# Altium project Supply_unit-RM.PrjPcb
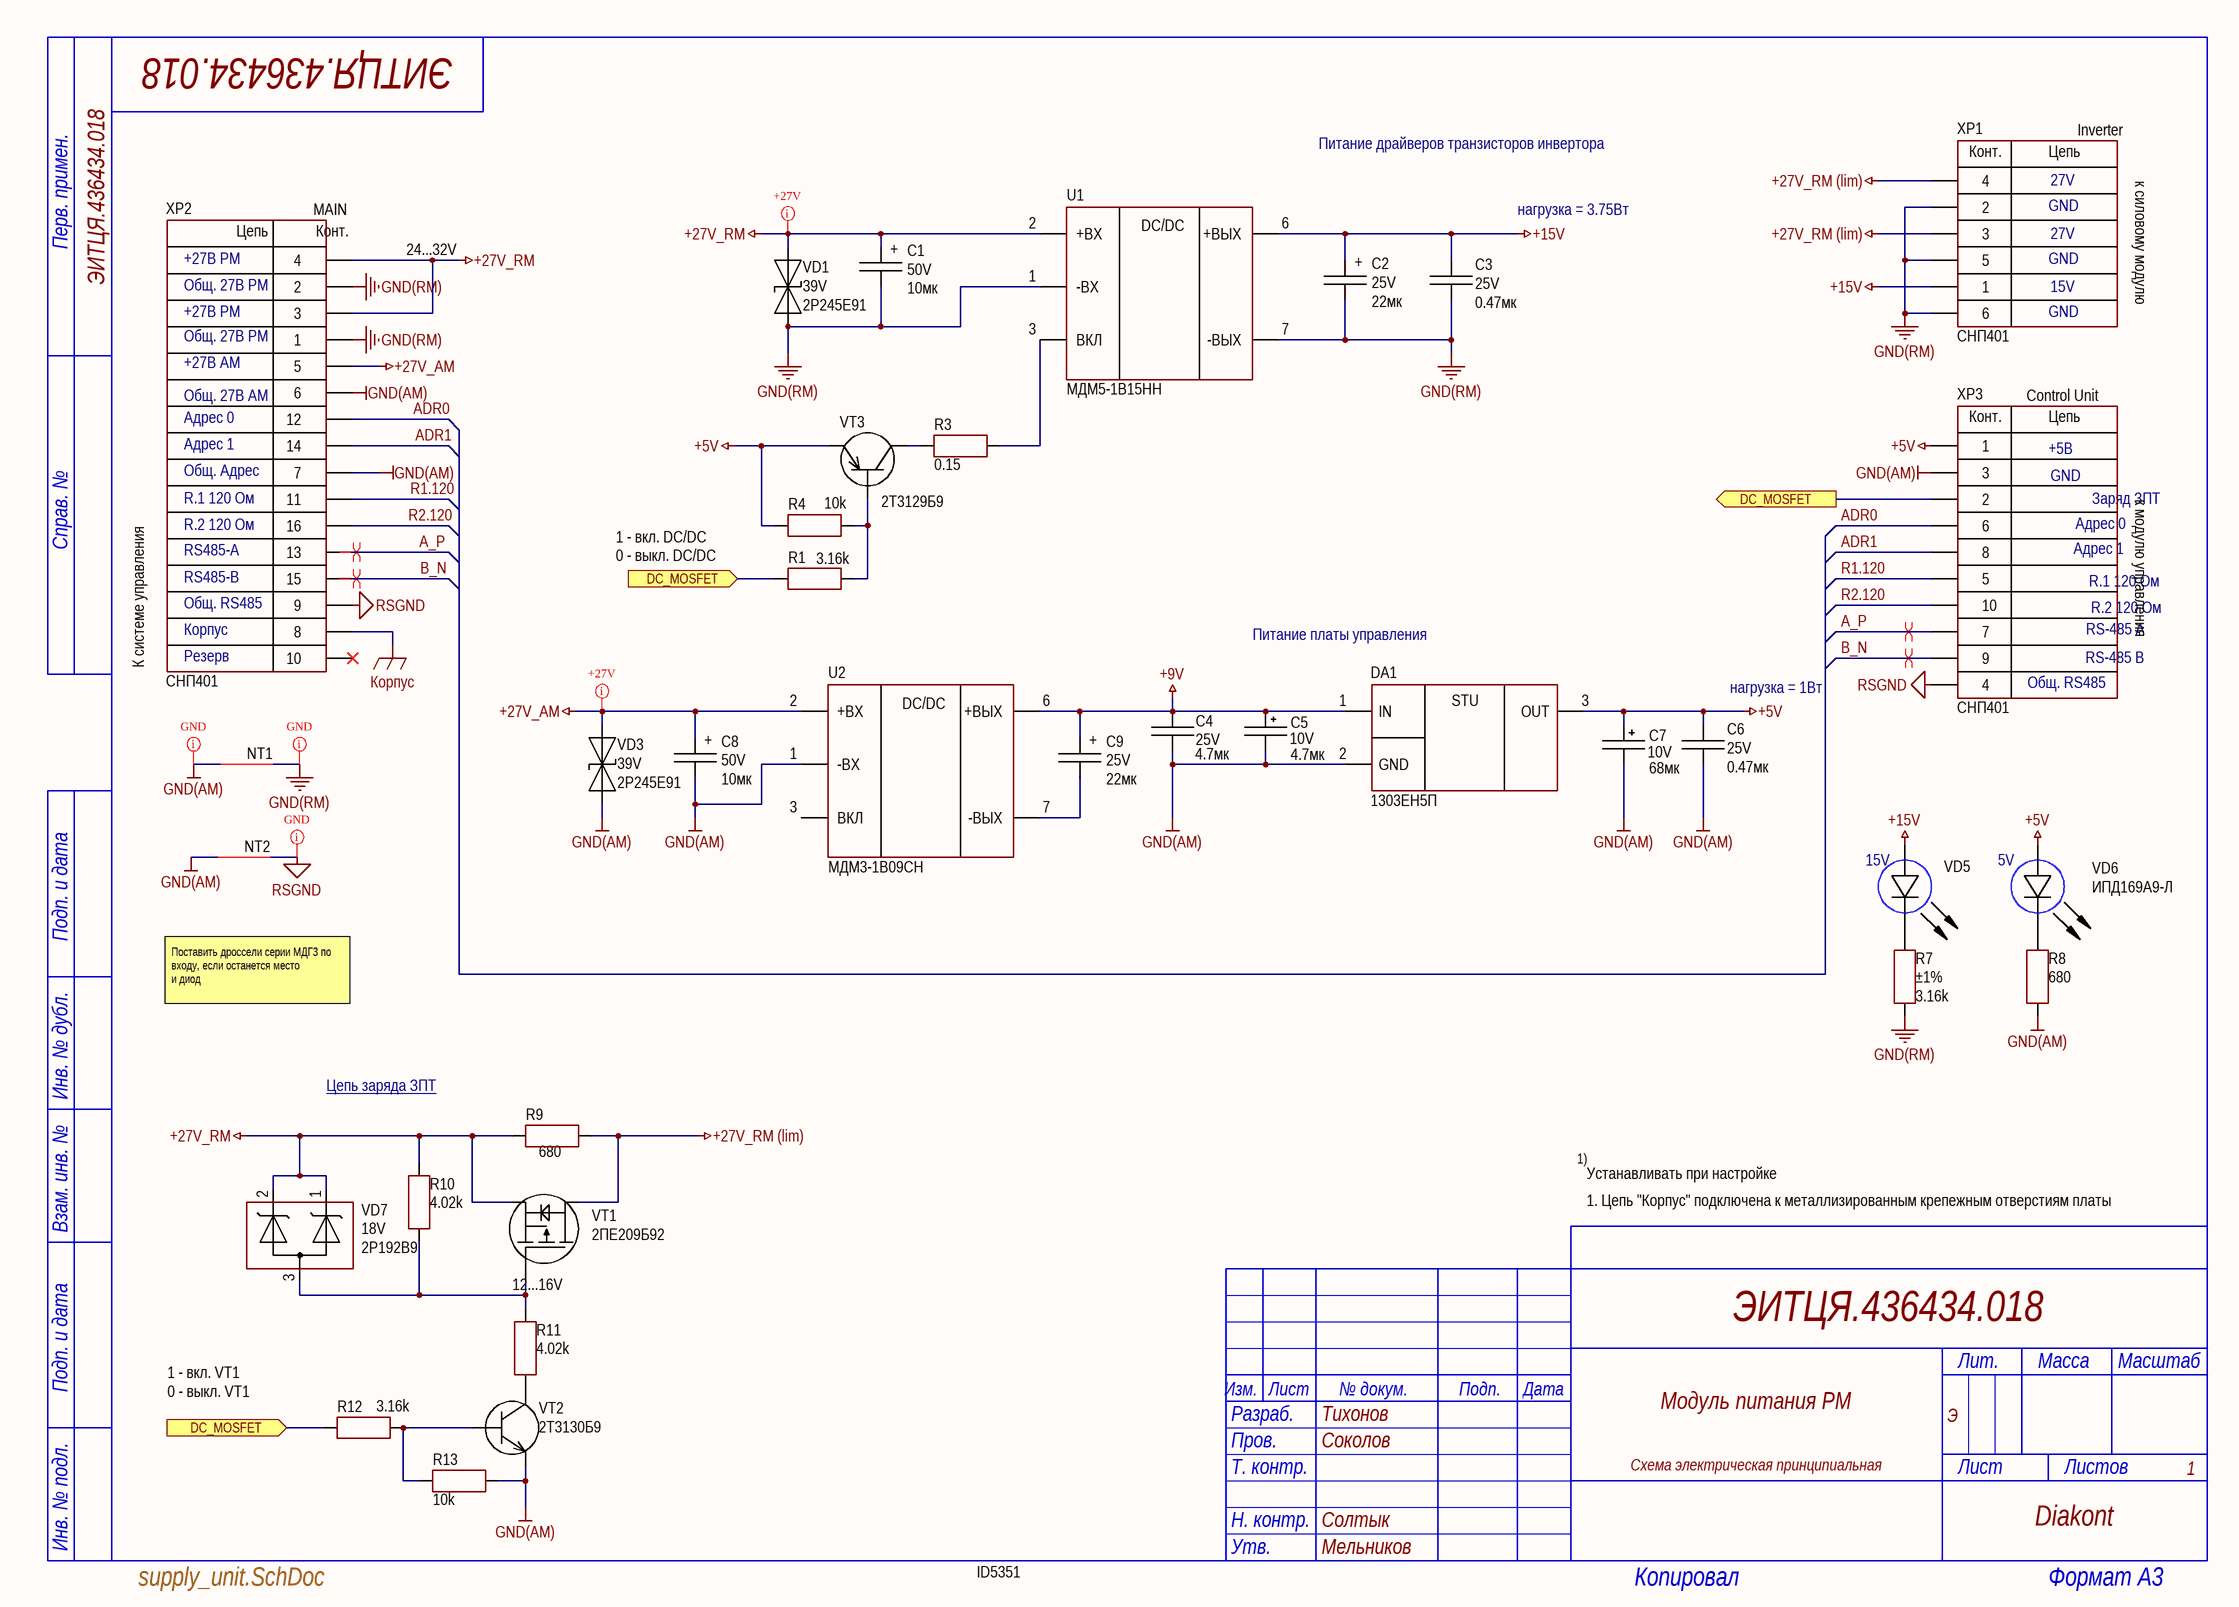
[diagram p0: supply_unit.SchDoc]
1 sheet, 35 parts. Net scope: flat (ports and power ports of the same name join across sheets).
Board file: PCB_supply unit.PcbDoc

## Sheet supply_unit.SchDoc: Модуль питания РМ
size 420 x 297 mm; Date: 2019-11-22; ApprovedBy: Мельников; CheckedBy: Соколов; CompanyName: Diakont; DrawnBy: Тихонов; DocumentNumber: ЭИТЦЯ.436434.018; Revision: A; SheetTotal: 1; DocumentType: Схема электрическая принципиальная; Liter: Э; NormControl: Солтык; PageSetup: Record=PageOptions|CenterHorizontal=True|CenterVertical=True|PrintScale=0.96|XCorrection=1.00|YCorrection=1.00|PrintKind=1|BorderSize=5000000|LeftOffset=0|BottomOffset=0|Orientation=2|PaperLength=1000|PaperWidth=1000|Scale=100|PaperSource=7|PrintQuality=-4|MediaType=1|DitherType=10|PaperKind=A3|PrintScaleMode=1; FirstApp: ЭИТЦЯ.436434.018; Language: en; ResponsibleDept: DED; DocumentStatus: Released; DecimalNumber: {DecimalNumber}

### Parts
C1  value 10мк  Polarity: +  Voltage: 50V  [CAP: TANTAL-E]
C2  value 22мк  Polarity: +  Voltage: 25V  [CAP: TANTAL-D]
C3  value 0.47мк  Voltage: 25V  [CAP: 1206]
C4  value 4.7мк  Voltage: 25V  [CAP: 1812]
C5  value 4.7мк  Voltage: 10V  [CAP: TANTAL-A]
C6  value 0.47мк  Voltage: 25V  [CAP: 1206]
C7  value 68мк  Voltage: 10V  [CAP: TANTAL-C]
C8  value 10мк  Polarity: +  Voltage: 50V  [CAP: TANTAL-E]
C9  value 22мк  Polarity: +  Voltage: 25V  [CAP: TANTAL-D]
DA1  (no value)  [TO220 (КТ-28А)]
NT1  (no value)  [NetTie_0603]  (net tie, no BOM)
NT2  (no value)  [NetTie_0603]  (net tie, no BOM)
R1  value 3.16k  [RES: 0603P]
R3  value 0.15  [RES: 0603P]
R4  value 10k  [RES: 0603P]
R7  value 3.16k  Tolerance: ±1%  [RES: 0603P]
R8  value 680  [RES: 0603P]
R9  value 680  [RES: 0805P]
R10  value 4.02k  [RES: 0805P]
R11  value 4.02k  [RES: 0805P]
R12  value 3.16k  [RES: 0603P]
R13  value 10k  [RES: 0603P]
U1  PartNumber: МДМ5-1В15НН  [SIP-8]
U2  (no value)  [SIP-8]
VD1  Voltage: 39V  PartNumber: 2Р245Е91  [DIODE: SMB]
VD3  Voltage: 39V  PartNumber: 2Р245Е91  [DIODE: SMB]
VD5  CommentText: 15V  [LED: 0603G]
VD6  PartNumber: ИПД169А9-Л  CommentText: 5V  [LED: 0603G]
VD7  Voltage: 18V  PartNumber: 2Р192В9  [SOT23]
VT1  PartNumber: 2ПЕ209Б92  [DPAK]
VT2  PartNumber: 2Т3130Б9  [SOT23]
VT3  PartNumber: 2Т3129Б9  [SOT23]
XP1  CommentText: СНП401  [CON: M80-5000605]
XP2  CommentText: СНП401  [CON: M80-5001605]
XP3  CommentText: СНП401  [CON: M80-5001005]

### Ports
DC_MOSFET (in), DC_MOSFET (out)

### Nets
+5V: C6.2 C7.1 DA1.3(OUT) R4.1 VD6.1(A) VT3.2(E) XP3.1
+9V: C4.2 C5.1 C9.2 DA1.1(IN) U2.6(+ВЫХ)
+15V: C2.2 C3.2 U1.6(+ВЫХ) VD5.1(A) XP1.1
+27V_AM: C8.2 U2.2(+ВХ) VD3.2(C) XP2.5
+27V_RM: C1.2 R9.1 R10.1 U1.2(+ВХ) VD1.2(C) VD7.1(K1) VD7.2(K2) VT1.2(S) XP2.3 XP2.4
+27V_RM (lim): R9.2 VT1.3(D) XP1.3 XP1.4
GND(AM): C4.1 C5.2 C6.1 C7.2 C8.1 DA1.2(GND) NT1.1 NT2.1 R8.2 R13.1 U2.1(-ВХ) VD3.1(A) VT2.2(E) XP2.6 XP2.7 XP3.3
GND(RM): C1.1 C2.1 C3.1 NT1.2 R7.1 U1.1(-ВХ) U1.7(-ВЫХ) VD1.1(A) XP1.2 XP1.5 XP1.6 XP2.1 XP2.2
RSGND: NT2.2 XP2.9 XP3.4
Корпус: XP2.8
A_P: XP2.13 XP3.7
ADR0: XP2.12 XP3.6
ADR1: XP2.14 XP3.8
B_N: XP2.15 XP3.9
DC_MOSFET: R1.2 R12.1 XP3.2 ; port DC_MOSFET
R1.120: XP2.11 XP3.5
R2.120: XP2.16 XP3.10
NetC9_1: C9.1 U2.7(-ВЫХ)
NetR1_1: R1.1 R4.2 VT3.1(B)
NetR3_1: R3.1 VT3.3(C)
NetR3_2: R3.2 U1.3(ВКЛ)
NetR7_2: R7.2 VD5.2(C)
NetR8_1: R8.1 VD6.2(C)
NetR10_2: R10.2 R11.1 VD7.3(A) VT1.1(G)
NetR11_2: R11.2 VT2.3(C)
NetR12_2: R12.2 R13.2 VT2.1(B)

Not connected (* = marked no-connect by the designer): U2 3(ВКЛ); XP2 10*

### Layout directives
differential pair: (no net found under the mark), A_P, B_N
net class +27V: +27V_AM, +27V_RM
net class GND: GND(AM), GND(RM), RSGND

### Notes on the sheet
- Питание драйверов транзисторов инвертора
- 27V
- Inverter
- к силовому модулю
- +27В РМ
- (near XP2) MAIN
- (near XP2) 24...32V
- нагрузка = 3.75Вт
- GND
- (near XP2) Общ. 27В РМ
- 15V
- (near XP2) Общ. 27В АМ
- +27В АМ
- Control Unit
- Адрес 0
- Адрес 1
- +5В
- К системе управления
- R.1 120 Ом
- R.2 120 Ом
- Общ. Адрес
- Заряд ЗПТ
- к модулю управления
- RS485-A
- RS485-B
- 1 - вкл. DC/DC
  0 - выкл. DC/DC
- (near XP3) R.1 120 Ом
- Общ. RS485
- Корпус
- Резерв
- Питание платы управления
- RS-485 B
- RS-485 A
- (near XP3) R.2 120 Ом
- нагрузка = 1Вт
- Поставить дроссели серии МДГ3 по входу, если останется место
  и диод
- Цепь заряда ЗПТ
- 1)
- Устанавливать при настройке
- 1. Цепь "Корпус" подключена к металлизированным крепежным отверстиям платы
- (near VT1) 12...16V
- 1 - вкл. VT1
  0 - выкл. VT1
- ID5351
- Перв. примен.
- Справ. №
- Подп. и дата
- Инв. № дубл.
- Взам. инв. №
- Изм.
- Лист
- № докум.
- Подп.
- Дата
- Лит.
- Масса
- Масштаб
- Разраб.
- Пров.
- Т. контр.
- Листов
- Инв. № подл.
- Н. контр.
- Утв.
- Копировал
- Формат A3
- (in symbol 1303ЕН5П) STU
- (in symbol M80-5000605 Harwin) Конт.; Цепь
- (in symbol M80-5001005 Harwin) Конт.; Цепь
- (in symbol M80-5001205 Harwin_1) Цепь; Конт.
- (in symbol МДМ3-1В09СН) DC/DC

### Library data of the parts
C1 C8 = Tantal_E: Manufacturer: Элеконд; PartNumber: К53-68 "E"-50 В-10мкф ±10%; ValueManufacturerPartNumber: Tantalum capacitor, 10мк, 50V, ±10%, 0.7 Ом, case E, -60...+125°C; Impedance: 0.7 Ом; Tolerance: ±10%; TypeCapacitor: Tantalum capacitor; MAX: 00145440; Analog: 00132739 (pin-to-pin на 15мкФ); Package: case E; HelpURL: https://eandc.ru/pdf/kondensator/k53-68.pdf; Temperature: -60...+125°C
C2 C9 = Tantal_E: Manufacturer: Элеконд; PartNumber: К53-68 "D"-25 В-22мкф ±10%; ValueManufacturerPartNumber: Tantalum capacitor, 22мк, 25V, ±10%, 0.7 Ом, case D, -60...+125°C; Impedance: 0.7 Ом; Tolerance: ±10%; TypeCapacitor: Tantalum capacitor; MAX: 00132735; Package: case D; HelpURL: https://eandc.ru/pdf/kondensator/k53-68.pdf; Temperature: -60...+125°C
C3 C6 = Ceramic_0603: Manufacturer: Монолит; PartNumber: К10-84в-3216М-25В-0,47 мкФ ±10%-Н90-N-A; ValueManufacturerPartNumber: Ceramic capacitor, 0.47мк, Н90, ±10%, 25V, 1206 (3216M),; TypeCapacitor: Ceramic capacitor; Tolerance: ±10%; TypeDielectric: Н90; Analog: MAX 00150226; Package: 1206 (3216M); HelpURL: http://www.monolit.vitebsk.by/Files/K10-84.pdf
C4 = Ceramic_1812: Manufacturer: Монолит; PartNumber: К10-84в-4532М-25В-4,7 мкФ +80/-20%-Н90-N-A; ValueManufacturerPartNumber: Ceramic capacitor, 4.7мк, H90, +80 -20%, 25V, 1812 (4532М) (4.5x3.2), -55...+125°C; TypeCapacitor: Ceramic capacitor; Tolerance: +80 -20%; TypeDielectric: H90; Package: 1812 (4532М) (4.5x3.2); HelpURL: http://www.monolit.vitebsk.by/Files/K10-84.pdf; Temperature: -55...+125°C
C5 = Tantal_A: Manufacturer: Элеконд; PartNumber: К53-68 "А"-10 В-4.7 мкф; ValueManufacturerPartNumber: Tantalum capacitor, 4.7мк, 10V, ±10%, 2Ohm, case A (3216), -55...+125°C; Impedance: 2Ohm; Tolerance: ±10%; TypeDielectric: X7R; TypeCapacitor: Tantalum capacitor; MAX: 00130629; Package: case A (3216); HelpURL: https://www.digikey.com/product-detail/en/avx-corporation/F930J107KAAAJ6/478-12404-1-ND/9645231; Temperature: -55...+125°C
C7 = Tantal_A: Manufacturer: Элеконд; PartNumber: К53-68 "C"-10 В-68 мкф; ValueManufacturerPartNumber: Tantalum capacitor, 68мк, 10V, ±10%, 1.2 - 1.8Ohm, case C, -55...+125°C; Impedance: 1.2 - 1.8Ohm; Tolerance: ±10%; TypeCapacitor: Tantalum capacitor; MAX: 00149801; Package: case C; HelpURL: https://www.digikey.com/product-detail/en/avx-corporation/F930J107KAAAJ6/478-12404-1-ND/9645231; Temperature: -55...+125°C
DA1 = 1303ЕН5П: Linear voltage regulator 5V; Manufacturer: ELTOM; ValueManufacturerPartNumber: Linear voltage regulator, input 5.8...16V, 0.6V, output 5V, 5A, -60...+125°C, КТ28А (TO-220); VoltageInput: input 5.8...16V; MaxDropout: 0.6V; CurrentOutput: 5A; VoltageOutput: output 5V; MAX: 00123023; HelpURL: https://eandc.ru/pdf/mikroskhema/1303en.pdf; Package: КТ28А (TO-220); ComponentType: Linear voltage regulator; Temperature: -60...+125°C; PartNumber: 1303ЕН5П
NT1 NT2 = NetTie
R1 R12 = Resistor_0603: Manufacturer: ОАО Ресурс; PartNumber: Р1-12-0,1ум.-3.16~кОм ±1%-М ШКАБ.434110.002 ТУ; ValueManufacturerPartNumber: Resistor film, 3.16k, ±1%, 0603, 0.1W, -55...+125°C; TypeResistor: Resistor film; Power: 0.1W; Tolerance: ±1%; MAX: 00134464; Package: 0603; HelpURL: https://aoresurs.com/catalog/chip_rezistory/rezistory-r1-12-kategoriya-kachestva-vp-/; Temperature: -55...+125°C
R3 = Resistor_0603: Manufacturer: ОАО Ресурс; PartNumber: Р1-12-0,1ум.-0.15~Ом ±20%-М ШКАБ.434110.002 ТУ; ValueManufacturerPartNumber: Resistor film, 0.15, ±20%, 0603, 0.1W, -55...+125°C; TypeResistor: Resistor film; Power: 0.1W; Tolerance: ±20%; MAX: 00133968; Analog: MAX 00117169 pin-to-pin; Package: 0603; HelpURL: https://aoresurs.com/catalog/chip_rezistory/rezistory-r1-12-kategoriya-kachestva-vp-/; Temperature: -55...+125°C
R4 R13 = Resistor_0603: Manufacturer: ОАО Ресурс; PartNumber: Р1-12-0,1ум.-10~кОм ±5%-М ШКАБ.434110.002 ТУ; ValueManufacturerPartNumber: Resistor film, 10k, ±5%, 0603, 0.1W, -55...+125°C; TypeResistor: Resistor film; Power: 0.1W; Tolerance: ±5%; Analog: MAX 00133986 (1%); Package: 0603; HelpURL: https://aoresurs.com/catalog/chip_rezistory/rezistory-r1-12-kategoriya-kachestva-vp-/; Temperature: -55...+125°C
R7 = Resistor_0603: Manufacturer: ОАО Ресурс; PartNumber: Р1-12-0,1ум.-3.16~кОм ±1%-М ШКАБ.434110.002 ТУ; ValueManufacturerPartNumber: Resistor film, 3.16k, ±1%, 0603, 0.1W, -55...+125°C; TypeResistor: Resistor film; Power: 0.1W; MAX: 00134464; Package: 0603; HelpURL: https://aoresurs.com/catalog/chip_rezistory/rezistory-r1-12-kategoriya-kachestva-vp-/; Temperature: -55...+125°C
R8 = Resistor_0603: Manufacturer: ОАО Ресурс; PartNumber: Р1-12-0,1ум.-680~Ом ±5%-М ШКАБ.434110.002 ТУ; ValueManufacturerPartNumber: Resistor film, 680, ±5%, 0603, 0.1W, -55...+125°C; TypeResistor: Resistor film; Power: 0.1W; Tolerance: ±5%; MAX: 00134086; Package: 0603; HelpURL: https://aoresurs.com/catalog/chip_rezistory/rezistory-r1-12-kategoriya-kachestva-vp-/; Temperature: -55...+125°C
R9 = Resistor_0805: Manufacturer: Ресурс; PartNumber: Р1-12-0,125-680 Ом ±5%-М ШКАБ.434110.002 ТУ; ValueManufacturerPartNumber: Resistor film, 680, ±5%, 0805, 0.125W,; TypeResistor: Resistor film; Power: 0.125W; Tolerance: ±5%; MAX: 00133924; Package: 0805; HelpURL: https://aoresurs.com/catalog/chip_rezistory/rezistory-r1-12-kategoriya-kachestva-vp-/
R10 = Resistor_0603: Manufacturer: ОАО Ресурс; PartNumber: Р1-12-0,1ум.-4.02~кОм ±1%-М ШКАБ.434110.002 ТУ; ValueManufacturerPartNumber: Resistor film, 4.02k, ±1%, 0805, 0.125W, -55...+125°C; TypeResistor: Resistor film; Power: 0.125W; Tolerance: ±1%; MAX: 00123886; Package: 0805; HelpURL: https://aoresurs.com/catalog/chip_rezistory/rezistory-r1-12-kategoriya-kachestva-vp-/; Temperature: -55...+125°C
R11 = Resistor_0603: Manufacturer: ОАО Ресурс; PartNumber: Р1-12-0,1ум.-4.02~кОм ±1%-М ШКАБ.434110.002 ТУ; ValueManufacturerPartNumber: Resistor film, 4.02k, ±1%, 0805, 0.125W, -55...+125°C; TypeResistor: Resistor film; Power: 0.125W; Tolerance: ±1%; Analog: 00123886; Package: 0805; HelpURL: https://aoresurs.com/catalog/chip_rezistory/rezistory-r1-12-kategoriya-kachestva-vp-/; Temperature: -55...+125°C
U1 = МДМ3-1В09СН: DC/DC converter; Manufacturer: Aedon; ValueManufacturerPartNumber: DC/DC converter, isolator, 15V 1.5A, -40...+105°C, SIP-8; OutputType: isolator; OutputVoltage: 15V 1.5A; Vin: 18-36V; HelpURL: https://www.aedon.ru/catalog/dcdc/models/96; Package: SIP-8; ComponentType: DC/DC converter; Temperature: -40...+105°C
U2 = МДМ3-1В09СН: DC/DC converter; Manufacturer: Aedon; ValueManufacturerPartNumber: DC/DC converter, isolator, 9V 900mA, -40...+105°C, SIP-8; OutputType: isolator; OutputVoltage: 9V 900mA; VIN: 18-36V; HelpURL: https://www.aedon.ru/catalog/dcdc/models/96; Package: SIP-8; ComponentType: DC/DC converter; Temperature: -40...+105°C; PartNumber: МДМ3-1В09СН
VD1 VD3 = TVS_single: Manufacturer: НЗПП; TypeDiode: Zener diode; Current: 8A; VoltageDrop: 0.9V; Analog: SMA6J33A; Package: SMB(КД-42); HelpURL: http://www.nzpp.ru/product/; ValueManufacturerPartNumber: =TypeDiode+', '+Voltage+', '+Current+', '+VoltageDrop+', '+RecoveryTime+', '+Package+', '+Temperature
VD5 = LED_single: Manufacturer: Протон; ValueManufacturerPartNumber: LED, 20mA max, 2.1V typ, 1608, -55...+150°C; PartNumber: ИПД169А9-Л; TypeDiode: LED; Current: 20mA max; VoltageDrop: 2.1V typ; Color: GREEN; Analog: MAX 00129484 КР-1608 Kingbright (pin-to-pin); Package: 1608; HelpURL: *; Temperature: -55...+150°C
VD6 = LED_single: Manufacturer: Протон; ValueManufacturerPartNumber: LED, 20mA max, 2.1V typ, 1608, -55...+150°C; TypeDiode: LED; Current: 20mA max; VoltageDrop: 2.1V typ; Color: GREEN; Analog: MAX 00129484 КР-1608 Kingbright (pin-to-pin); Package: 1608; HelpURL: *; Temperature: -55...+150°C
VD7 = TVS_array_var2: Manufacturer: КРИП; TypeDiode: TVS diode; Current: 1A; Uогр.: 22.5V; Cap: 21pF; NOTE: указано для pin1-pin3; Analog: КР192А9 (ОТК) (pin-to-pin); Package: SOT-23; ValueManufacturerPartNumber: =TypeDiode+', '+Voltage+', '+Current+', '+VoltageDrop+', '+RecoveryTime+', '+Package+', '+Temperature; Temperature: -55...+150°C
VT1 = MOSFET_P_132: Manufacturer: Ангстрем; ValueManufacturerPartNumber: MOSFET P-channel transistor, 60V, 22A, 2.9nC, 2.5W, 40mOhm, 220pF, KT-89 (DPAK/TO-252), -55...+150°C; TypeTransistor: MOSFET P-channel transistor; VoltageDS: 60V; CurrentDS: 22A; RDS: 40mOhm; GateCharge: 2.9nC; InputCapacitor: 220pF; MaxPower: 2.5W; Analog: SUD50P06-15 (pin-to-pin); Package: KT-89 (DPAK/TO-252); HelpURL: https://www.vishay.com/docs/68940/sud50p06-15.pdf; Temperature: -55...+150°C
VT2 = BJT_NPN_132: Manufacturer: ООО НПК Далекс; ValueManufacturerPartNumber: NPN transistor, 30V, 100mA, , 300mW, 0.7V, 500, SOT-23 (КТ-46), -55...+125°C; TypeTransistor: NPN transistor; VoltageCE: 30V; CurrentCE: 100mA; VoltageSaturation: 0.7V; CurrentGain: 500; MaxPower: 300mW; MAX: 00123842; Package: SOT-23 (КТ-46); HelpURL: http://www.radioman-portal.ru/sprav/pp/transisters/sourse/2t3130.pdf; Temperature: -55...+125°C
VT3 = BJT_PNP_123: ValueManufacturerPartNumber: NPN transistor, 40V, 100mA, , 200mW, 1.3V, 220, SOT-23 (КТ-46),; TypeTransistor: NPN transistor; VoltageCE: 40V; CurrentCE: 100mA; VoltageSaturation: 1.3V; CurrentGain: 220; MaxPower: 200mW; MAX: 00123135; Package: SOT-23 (КТ-46); HelpURL: https://eandc.ru/pdf/tranzistor/2t3129_kt3129.pdf
XP1 = M80-5000605 Harwin: вилка на плату; Manufacturer: Электроделать; ValueManufacturerPartNumber: Вилка, 6pin, 2mm, 120VAC, 1.5A; PartNumber: СНП401-6ВП21-3-1-1; VoltageMax: 120VAC; Pitch: 2mm; CurrentMax: 1.5A; Multichannel: 6pin; Analog: MAX 00126397 (M80-5000605 pin-to-pin); HelpURL: https://eu.mouser.com/ProductDetail/Harwin/M80-5000605?qs=yQtJ9TWM%2F1KaJIUUBEXorg%3D%3D; TypeConnector: Вилка
XP2 = M80-5001205 Harwin_1: вилка на плату; Manufacturer: Электродеталь; ValueManufacturerPartNumber: , 16pin, 2mm, 120VAC, 1.5A; PartNumber: СНП401-16ВП21-3-1-1; VoltageMax: 120VAC; Pitch: 2mm; CurrentMax: 1.5A; Multichannel: 16pin; Analog: MAX 00139241 [М80-5101605] (pin-to-pin); HelpURL: https://www.digikey.com/product-detail/en/harwin-inc/M80-5001605/952-2626-ND/5175716
XP3 = M80-5001005 Harwin: вилка на плату; Manufacturer: Электродеталь; ValueManufacturerPartNumber: Вилка, 10pin, 2mm, 100V, 1.5A; PartNumber: СНП401-10ВП21-3-1-1; VoltageMax: 100V; Pitch: 2mm; CurrentMax: 1.5A; Multichannel: 10pin; Analog: MAX 00126377 (M80-5001042 pin-to-pin); HelpURL: https://eu.mouser.com/ProductDetail/Harwin/M80-5001005?qs=yQtJ9TWM%2F1KRz59nPe3lqQ%3D%3D; TypeConnector: Вилка